# EAGLE schematic arduino_to_esp8266-01 (EAGLE 8.6.3)
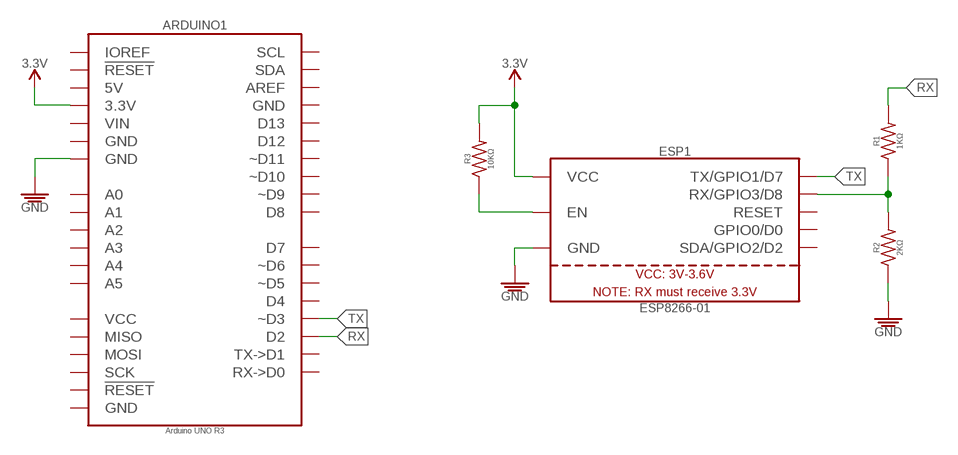
[diagram p0: schematic, sheet 1]

## Parts
ARDUINO1  Arduino UNO R3  ARDUINO_UNO_R3  [ARDUINO_UNO_R3]
ESP1  ESP8266-01  [ESP8266-01]
R1  1KΩ  1KΩ_PTH-0207/7_1/8W-5%  [RESISTOR-PTH-0207/7]
R2  2KΩ  2KΩ_PTH-0207/7_1/8W-5%  [RESISTOR-PTH-0207/7]
R3  10KΩ  10KΩ_PTH-0207/7_1/8W-5%  [RESISTOR-PTH-0207/7]

## Nets
3.3V: ARDUINO1.3.3V ESP1.VCC R3.2
GND: ARDUINO1.GND@3(GND) ESP1.GND R2.1
N$3: ESP1.EN R3.1
N$5: ESP1.RX(RX/GPIO3/D8) R1.1 R2.2
RX: ARDUINO1.D2 R1.2
TX: ARDUINO1.D3(~D3) ESP1.TX(TX/GPIO1/D7)
Unconnected: ARDUINO1.5V ARDUINO1.A0 ARDUINO1.A1 ARDUINO1.A2 ARDUINO1.A3 ARDUINO1.A4 ARDUINO1.A5 ARDUINO1.AREF ARDUINO1.D0(RX->D0) ARDUINO1.D1(TX->D1) ARDUINO1.D4 ARDUINO1.D5(~D5) ARDUINO1.D6(~D6) ARDUINO1.D7 ARDUINO1.D8 ARDUINO1.D9(~D9) ARDUINO1.D10(~D10) ARDUINO1.D11(~D11) ARDUINO1.D12 ARDUINO1.D13 ARDUINO1.GND@1(GND) ARDUINO1.GND@2(GND) ARDUINO1.GND@4(GND) ARDUINO1.IOREF ARDUINO1.MISO ARDUINO1.MOSI ARDUINO1.RESET@1(!RESET!) ARDUINO1.RESET@2(!RESET!) ARDUINO1.SCK ARDUINO1.SCL ARDUINO1.SDA ARDUINO1.VCC ARDUINO1.VIN ESP1.GPIO0(GPIO0/D0) ESP1.GPIO2(SDA/GPIO2/D2) ESP1.RESET

## Library data of the parts
ARDUINO1 = PiB_boards:ARDUINO_UNO_R3; DATASHEET: https://media.digikey.com/pdf/Data%20Sheets/Arduino%20PDFs/A000066_Web.pdf; DIST: Digikey; DISTLINK: https://www.digikey.com/products/en?keywords=1050-1024-ND; DISTPN: 1050-1024-ND; MFR: Arduino; MPN: A000066
ESP1 = PiB_radio_frequency:ESP8266-01: TXRX ESP8266 MOD WIFI TRACE ANT; DATASHEET: https://nurdspace.nl/images/e/e0/ESP8266_Specifications_English.pdf; DIST: Digikey; DISTLINK: https://www.digikey.com/products/en?keywords=1568-1235-ND; DISTPN: 1568-1235-ND; MFR: SparkFun Electronics; MPN: WRL-13678
R1 = PiB_resistors:1KΩ; CREATOR: MrSwirlyEyes; TESTED: NO
R2 = PiB_resistors:2KΩ; CREATOR: MrSwirlyEyes; TESTED: NO
R3 = PiB_resistors:10KΩ; CREATOR: MrSwirlyEyes; TESTED: NO